# Altium schematic sheet SheetProjectX.SchDoc
size A4
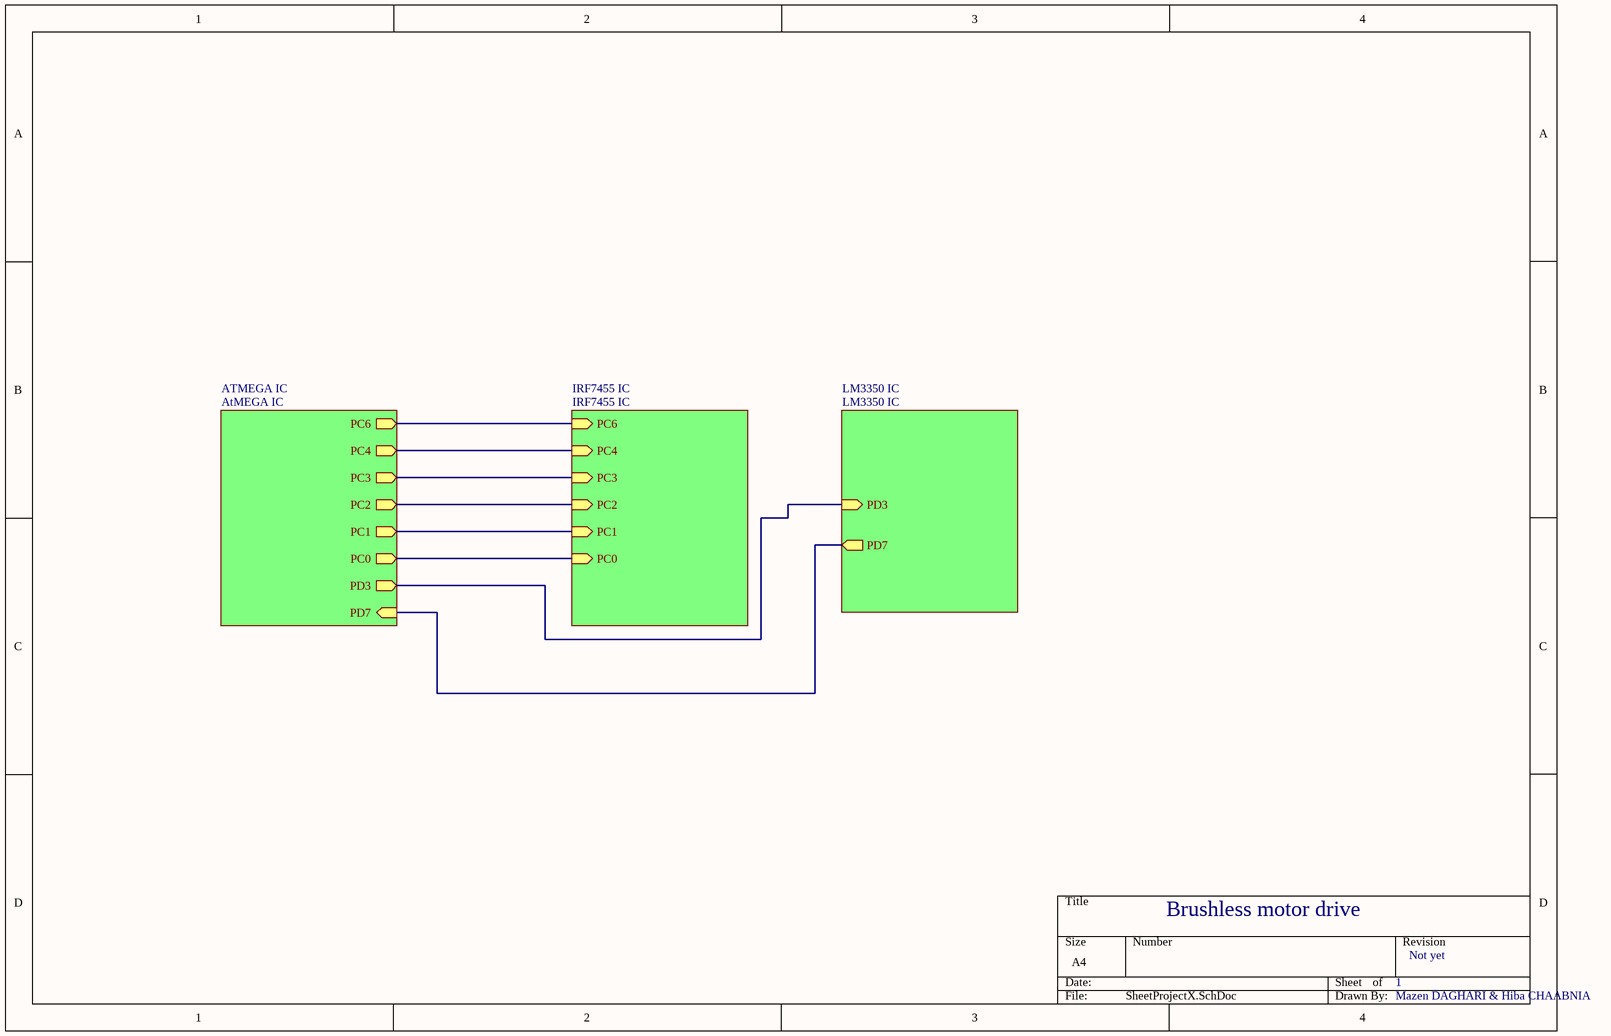
[diagram p0: SheetProjectX.SchDoc]

## Sub-sheets
ATMEGA IC = AtMEGA IC: PC6 (out), PC4 (out), PC3 (out), PC2 (out), PC1 (out), PC0 (out), PD3 (out), PD7 (in)
IRF7455 IC = IRF7455 IC: PC1 (in), PC6 (in), PC4 (in), PC3 (in), PC2 (in), PC0 (in)
LM3350 IC = LM3350 IC: PD3 (in), PD7 (out)

## Nets
(unnamed): sheet IRF7455 IC/PC1, sheet ATMEGA IC/PC1
(unnamed): sheet IRF7455 IC/PC6, sheet ATMEGA IC/PC6
(unnamed): sheet IRF7455 IC/PC4, sheet ATMEGA IC/PC4
(unnamed): sheet IRF7455 IC/PC3, sheet ATMEGA IC/PC3
(unnamed): sheet IRF7455 IC/PC2, sheet ATMEGA IC/PC2
(unnamed): sheet IRF7455 IC/PC0, sheet ATMEGA IC/PC0
(unnamed): sheet LM3350 IC/PD3, sheet ATMEGA IC/PD3
(unnamed): sheet LM3350 IC/PD7, sheet ATMEGA IC/PD7

## Notes on the sheet
- Brushless motor drive
- 1
- Not yet
- Mazen DAGHARI & Hiba CHAABNIA